# Altium schematic sheet Power Supply.SchDoc
size A
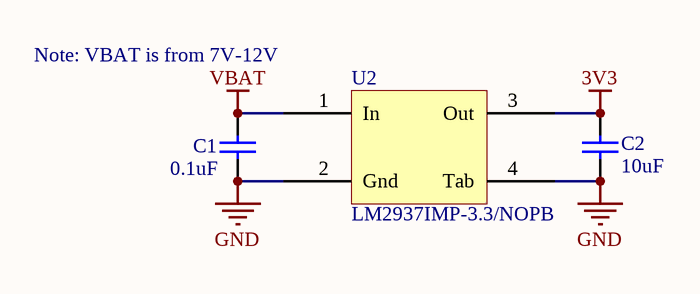
[diagram p0: Power Supply.SchDoc]

## Parts
C1  0.1uF  [C1206]
C2  10uF  [C1206]
U2  LM2937IMP-3.3/NOPB  [DSO-G3/C6.4]

## Nets
3V3: C2.2 U2.3(Out)
GND: C1.1 C2.1 U2.2(Gnd) U2.4(Tab)
VBAT: C1.2 U2.1(In)

## Notes on the sheet
- Note: VBAT is from 7V-12V

## Library data of the parts
C1 = Cap Semi: Regulator Filter Cap; Published: 8-Jun-2000; LatestRevisionDate: 29-May-2009; LatestRevisionNote: IPC-7351 Footprint Added.; PackageReference: C1206; Publisher: Altium Limited; PackageDescription: Chip Capacitor; Value: 0.1uF
C2 = Cap Semi: 1206 Ceramic Capacitor; Published: 8-Jun-2000; LatestRevisionDate: 29-May-2009; LatestRevisionNote: IPC-7351 Footprint Added.; PackageReference: C1206; Publisher: Altium Limited; PackageDescription: Chip Capacitor; Value: 10uF